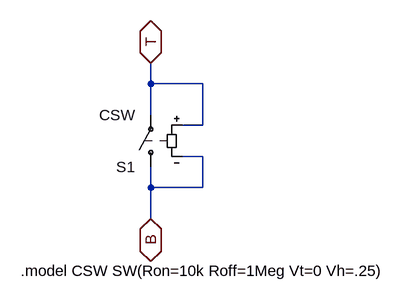
[diagram p0: schematic mbit.asc]
mbit.asc, the LTspice schematic file:
Version 4
SHEET 1 984 680
WIRE -288 -128 -288 -160
WIRE -208 -128 -288 -128
WIRE -288 -80 -288 -128
WIRE -208 -64 -208 -128
WIRE -208 -64 -240 -64
WIRE -208 -16 -240 -16
WIRE -288 32 -288 0
WIRE -208 32 -208 -16
WIRE -208 32 -288 32
WIRE -288 80 -288 32
FLAG -288 -160 T
IOPIN -288 -160 BiDir
FLAG -288 80 B
IOPIN -288 80 BiDir
SYMBOL sw -288 16 R180
SYMATTR InstName S1
SYMATTR Value CSW
TEXT -488 160 Left 0 !.model CSW SW(Ron=10k Roff=1Meg Vt=0 Vh=.25)

The netlist it stands for:
* mbit.asc
S1 B T T B CSW
.model CSW SW(Ron=10k Roff=1Meg Vt=0 Vh=.25)
.backanno
.end